# Altium schematic sheet main.SchDoc
size A
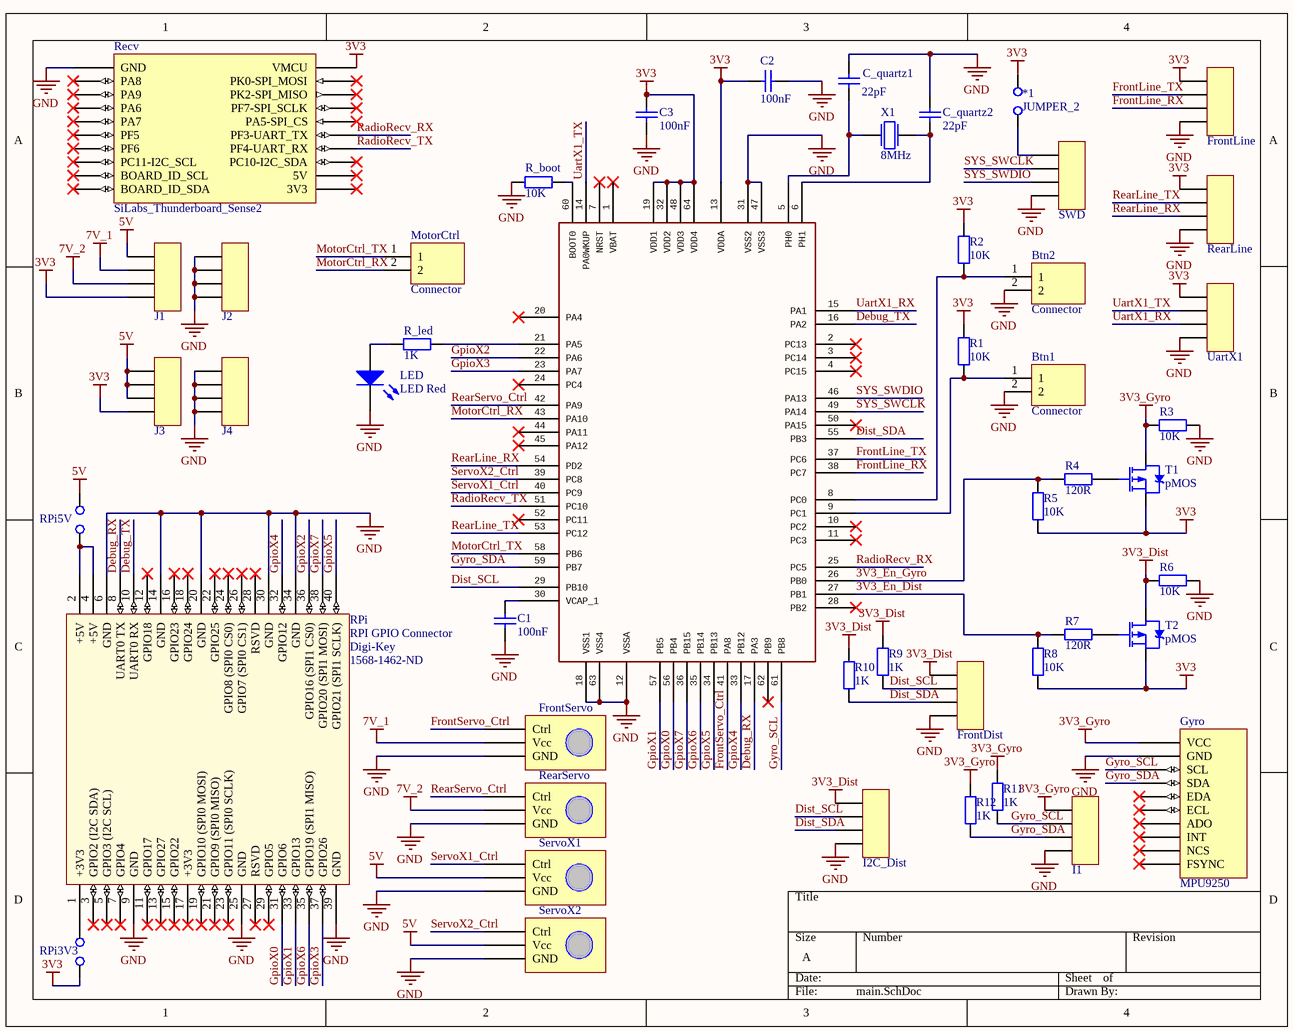
[diagram p0: main.SchDoc]

## Parts
1  64-pin STM32F4 chip with symbol for Foxcar Control Board v1.  [LQFP64]  (value not drawn)
*1  JUMPER_2  [JUMPER_2]
Btn1  Connector  [FP_CONN2_TUSKE_254MM]
Btn2  Connector  [FP_CONN2_TUSKE_254MM]
C1  100nF  [FP_0805_CAP_085]
C2  100nF  [FP_0805_CAP_085]
C3  100nF  [FP_0805_CAP_085]
C_quartz1  22pF  [FP_0805_CAP_085]
C_quartz2  22pF  [FP_0805_CAP_085]
FrontDist  4-Pin Header  [4-Pin Header]  (value not drawn)
FrontLine  4-Pin Header  [4-Pin Header]  (value not drawn)
FrontServo  ServoMotor  [Servo_motor]  (value not drawn)
Gyro  MPU9250  [MPU9250]
I1  4-Pin Header  [4-Pin Header]  (value not drawn)
I2C_Dist  4-Pin Header  [4-Pin Header]  (value not drawn)
J1  4-Pin Header  [4-Pin Header]  (value not drawn)
J2  4-Pin Header  [4-Pin Header]  (value not drawn)
J3  4-Pin Header  [4-Pin Header]  (value not drawn)
J4  4-Pin Header  [4-Pin Header]  (value not drawn)
LED  LED Red  [FP_0805_LED_RED]
MotorCtrl  Connector  [FP_CONN2_TUSKE_254MM]
R1  10K  [FP_0805_RES]
R2  10K  [FP_0805_RES]
R3  10K  [FP_0805_RES]
R4  120R  [FP_0805_RES]
R5  10K  [FP_0805_RES]
R6  10K  [FP_0805_RES]
R7  120R  [FP_0805_RES]
R8  10K  [FP_0805_RES]
R9  1K  [FP_0805_RES]
R10  1K  [FP_0805_RES]
R11  1K  [FP_0805_RES]
R12  1K  [FP_0805_RES]
R_boot  10K  [FP_0805_RES]
R_led  1K  [FP_0805_RES]
RearLine  4-Pin Header  [4-Pin Header]  (value not drawn)
RearServo  ServoMotor  [Servo_motor]  (value not drawn)
Recv  SiLabs_Thunderboard_Sense2  [SiLabs_Thunderbird_Sense2]
RPi  RPI GPIO Connector  Supplier 1: Digi-Key  Supplier Part Number 1: 1568-1462-ND  [rpi]
RPi3V3  (no value)  [JUMPER_2]
RPi5V  (no value)  [JUMPER_2]
ServoX1  ServoMotor  [Servo_motor]  (value not drawn)
ServoX2  ServoMotor  [Servo_motor]  (value not drawn)
SWD  4-Pin Header  [4-Pin Header]  (value not drawn)
T1  pMOS  [FP_SOT23-3]
T2  pMOS  [FP_SOT23-3]
UartX1  4-Pin Header  [4-Pin Header]  (value not drawn)
X1  8MHz  [FP_CRYSTAL_HC49_SMD]

## Nets
3V3: 1.13(VDDA) 1.19(VDD1) 1.32(VDD2) 1.48(VDD3) 1.64(VDD4) *1.2(C2) C2.2 C3.2 FrontLine.1 J1.4 J3.4 R1.2 R2.2 R5.1 R8.1 RearLine.1 Recv.2(VMCU) RPi3V3.1(C1) T1.2(S) T2.2(S) UartX1.1
3V3_Dist: FrontDist.1 I2C_Dist.1 R6.1 R9.2 R10.2 T2.3(D)
3V3_Gyro: Gyro.VCC I1.1 R3.1 R11.2 R12.2 T1.3(D)
5V: J1.1 J3.1 J3.2 J3.3 RPi5V.2(C2) ServoX1.Vcc ServoX2.Vcc
7V_1: FrontServo.Vcc J1.2
7V_2: J1.3 RearServo.Vcc
GND: 1.12(VSSA) 1.18(VSS1) 1.31(VSS2) 1.47(VSS3) 1.63(VSS4) Btn1.2 Btn2.2 C1.1 C2.1 C3.1 C_quartz1.1 C_quartz2.1 FrontDist.4 FrontLine.4 FrontServo.GND Gyro.GND I1.4 I2C_Dist.4 J2.1 J2.2 J2.3 J2.4 J4.1 J4.2 J4.3 J4.4 LED.2(K) R3.2 R6.2 R_boot.1 RearLine.4 RearServo.GND Recv.1(GND) RPi.6(GND) RPi.9(GND) RPi.14(GND) RPi.20(GND) RPi.25(GND) RPi.30(GND) RPi.34(GND) RPi.39(GND) ServoX1.GND ServoX2.GND SWD.4 UartX1.4
3V3_En_Dist: 1.27(PB1) R7.1 R8.2
3V3_En_Gyro: 1.26(PB0) R4.1 R5.2
Debug_RX: 1.17(PA3) RPi.8(UART0_TX)
Debug_TX: 1.16(PA2) RPi.10(UART0_RX)
Dist_SCL: 1.29(PB10) FrontDist.2 I2C_Dist.2 R9.1
Dist_SDA: 1.55(PB3) FrontDist.3 I2C_Dist.3 R10.1
FrontLine_RX: 1.38(PC7) FrontLine.3
FrontLine_TX: 1.37(PC6) FrontLine.2
FrontServo_Ctrl: 1.41(PA8) FrontServo.Ctrl
GpioX0: 1.56(PB4) RPi.31(GPIO6)
GpioX1: 1.57(PB5) RPi.33(GPIO13)
GpioX2: 1.22(PA6) RPi.36(GPIO16_(SPI1_CS0))
GpioX3: 1.23(PA7) RPi.37(GPIO26)
GpioX4: 1.33(PB12) RPi.32(GPIO12)
GpioX5: 1.34(PB13) RPi.40(GPIO21_(SPI1_SCLK))
GpioX6: 1.35(PB14) RPi.35(GPIO19_(SPI1_MISO))
GpioX7: 1.36(PB15) RPi.38(GPIO20_(SPI1_MOSI))
Gyro_SCL: 1.61(PB8) Gyro.SCL I1.2 R11.1
Gyro_SDA: 1.59(PB7) Gyro.SDA I1.3 R12.1
MotorCtrl_RX: 1.43(PA10) MotorCtrl.2
MotorCtrl_TX: 1.58(PB6) MotorCtrl.1
RadioRecv_RX: 1.25(PC5) Recv.12(PF3-UART_TX)
RadioRecv_TX: 1.51(PC10) Recv.14(PF4-UART_RX)
RearLine_RX: 1.54(PD2) RearLine.3
RearLine_TX: 1.53(PC12) RearLine.2
RearServo_Ctrl: 1.42(PA9) RearServo.Ctrl
ServoX1_Ctrl: 1.40(PC9) ServoX1.Ctrl
ServoX2_Ctrl: 1.39(PC8) ServoX2.Ctrl
SYS_SWCLK: 1.49(PA14) SWD.2
SYS_SWDIO: 1.46(PA13) SWD.3
UartX1_RX: 1.15(PA1) UartX1.3
UartX1_TX: 1.14(PA0WKUP) UartX1.2
Net1_5: 1.5(PH0) C_quartz1.2 X1.1
Net1_6: 1.6(PH1) C_quartz2.2 X1.2
Net1_8: 1.8(PC0) Btn2.1 R2.1
Net1_9: 1.9(PC1) Btn1.1 R1.1
Net1_21: 1.21(PA5) R_led.1
Net1_30: 1.30(VCAP_1) C1.2
Net1_60: 1.60(BOOT0) R_boot.2
Net*1_1: *1.1(C1) SWD.1
NetLED_1: LED.1(A) R_led.2
NetR4_2: R4.2 T1.1(G)
NetR7_2: R7.2 T2.1(G)
NetRPi_1: RPi.1(+3V3) RPi3V3.2(C2)
NetRPi_2: RPi.2(+5V) RPi.4(+5V) RPi5V.1(C1)

Not connected (* = marked no-connect by the designer): 1 1(VBAT)* 2(PC13)* 3(PC14)* 4(PC15)* 7(NRST)* 10(PC2)* 11(PC3)* 20(PA4)* 24(PC4)* 28(PB2)* 44(PA11)* 45(PA12)* 50(PA15)* 52(PC11)* 62(PB9)*; Gyro ADO* ECL* EDA* FSYNC* INT* NCS*; Recv 3(PA8)* 4(PK0-SPI_MOSI)* 5(PA9)* 6(PK2-SPI_MISO)* 7(PA6)* 8(PF7-SPI_SCLK)* 9(PA7)* 10(PA5-SPI_CS)* 11(PF5)* 13(PF6)* 15(PC11-I2C_SCL)* 16(PC10-I2C_SDA)* 17(BOARD_ID_SCL)* 18(5V)* 19(BOARD_ID_SDA)* 20(3V3)*; RPi 3(GPIO2_(I2C_SDA))* 5(GPIO3_(I2C_SCL))* 7(GPIO4)* 11(GPIO17)* 12(GPIO18)* 13(GPIO27)* 15(GPIO22)* 16(GPIO23)* 17(+3V3)* 18(GPIO24)* 19(GPIO10_(SPI0_MOSI))* 21(GPIO9_(SPI0_MISO))* 22(GPIO25)* 23(GPIO11_(SPI0_SCLK))* 24(GPIO8_(SPI0_CS0))* 26(GPIO7_(SPI0_CS1))* 27(RSVD)* 28(RSVD)* 29(GPIO5)*

## Library data of the parts
1 = STM32F4R_64PIN_FOXCAR: GateName_1: G$1; SymbolName_1: STM32F4_64PINS_FOXCARV1; LibraryName: stm32f4; DeviceSetName: STM32F4R_64PIN_FOXCAR; Package: LQFP64
Btn1 Btn2 MotorCtrl = Connector_2pin: 2pin connector
C1-C3 = CAP 100nF: Capacitor; Tolerance: +80%/-20%; Voltage: 25V; Reference: 1759167; Name: SMD Multilayer Ceramic Capacitor, 0805; Supplier: Farnell; Value: 100nF
C_quartz1 C_quartz2 = CAP 22pF: Capacitor; Tolerance: 5%; Voltage: 50V; Reference: 1759195; Name: SMD Multilayer Ceramic Capacitor, 0805; Supplier: Farnell; Value: 22pF
FrontServo RearServo ServoX1 ServoX2 = ServoMotor: Servo motor; Name: MG996R servo motor; Reference: 201606181242; Supplier: eBay
LED = LED Red: Red LED; pin to pad: 1>A 2>K; U_fw: 1.85V; I_max: 20mA; Reference: 1581239; Name: MULTICOMP  MCL-S270SRC  LED, Red, SMD, 1.25mm x 1.4mm, 20 mA, 1.85 V, 643 nm; Wavelength: 643nm; Supplier: Farnell
R1-R3 R5 R6 R8 R_boot = RES 10K: Resistor; Tolerance: 5%; Power: 125mW; Name: YAGEO (PHYCOMP)  RC0805JR-0710KL  SMD Chip Resistor, Thick Film, 10 kohm; Reference: 9234136; Supplier: Farnell; Value: 10K
R4 R7 = RES 120R: Resistor; Tolerance: 5%; Power: 125mW; Name: YAGEO (PHYCOMP)  RC0805JR-07120RL  SMD Chip Resistor, Thick Film, 120 ohm; Reference: 9233890; Supplier: Farnell; Value: 120R
R9-R12 R_led = RES 1K: Resistor; Tolerance: 5%; Power: 125mW; Name: YAGEO (PHYCOMP)  RC0805JR-071KL  SMD Chip Resistor, Thick Film, 1 kohm; Reference: 9234004; Supplier: Farnell; Value: 1K
Recv = SiLabs_Thunderboard_Sense2: Radio transmitter/receiver
RPi = rpi connector: GPIO Header for Raspberry Pi A+/B+/Pi 2/Pi 3 - 2x20; Manufacturer: SparkFun Electronics; Manufacturer Part Number: PRT-14017; Nils Minor: author; nilsminor@web.de: mail; RoHS: RoHS Compliant; Category: Development Boards, Kits, Programmers; Stock 1: 150; Pricing 1: 1=1.84 (EUR); Part Status: Active; Accessory Type: Connector; For Use With/Related Products: Raspberry Pi; ComponentLink1URL: https://cdn.sparkfun.com/datasheets/Dev/RaspberryPi/12313.pdf; ComponentLink1Description: https://cdn.sparkfun.com/datasheets/Dev/RaspberryPi/12313.pdf
RPi3V3 RPi5V = JUMPER_2
T1 T2 = pMOS: pMOS FET; Reference: 1094997; Name: BSS84 pMOS FET; Supplier: Farnell
X1 = Crystal: Quarz Crystal; Value: 8MHz